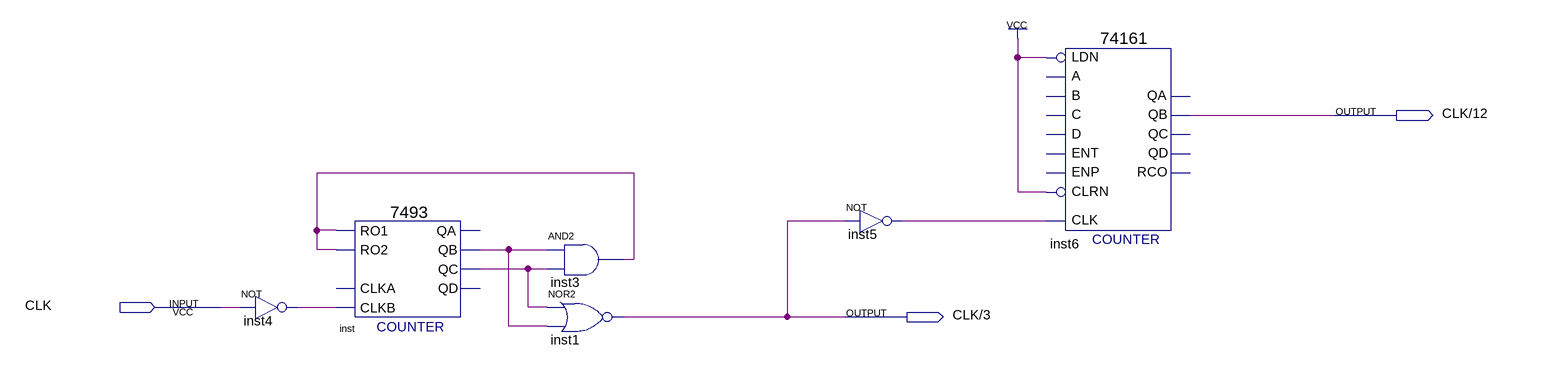
[diagram p0: schematic sheet]
// Quartus schematic div_freq.bdf as structural Verilog: 6 symbols, 3 pins
module div_freq (
  input  CLK,
  output \CLK/12 ,
  output \CLK/3 
);

  wire inst3_out, inst4_out, inst5_out, inst_qb, inst_qc;

  not inst4 (inst4_out, CLK);
  \7493  inst (.RO1(inst3_out), .RO2(inst3_out), .CLKB(inst4_out), .QC(inst_qc), .QB(inst_qb));  // open: CLKA, QA, QD
  and inst3 (inst3_out, inst_qb, inst_qc);
  nor inst1 (\CLK/3 , inst_qc, inst_qb);
  not inst5 (inst5_out, \CLK/3 );
  \74161  inst6 (
    .CLRN(1'b1), .CLK(inst5_out), .LDN(1'b1), .QB(\CLK/12 ));  // open: ENP, A, D, ENT, B, C, QD, QC, QA, RCO
endmodule
